# Altium schematic sheet AMU-S28-V00-USBCProtection.SchDoc
size A4; SheetNumber: 25; SheetTotal: 25
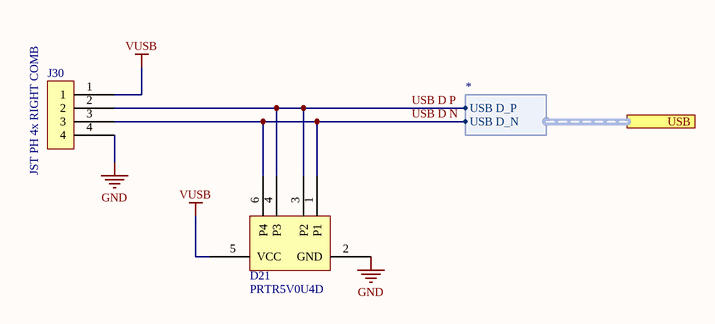
[diagram p0: AMU-S28-V00-USBCProtection.SchDoc]

## Parts
D21  PRTR5V0U4D  [SC-47]
J30  JST PH 4x RIGHT COMB  [JST PH 4x RIGHT COMB]

## Ports
USB (harness *)

## Harnesses
*: USB D_P, USB D_N

## Nets
GND: D21.2(GND) J30.4
VUSB: D21.5(VCC) J30.1
USB D N: D21.1(P1) D21.6(P4) J30.3 ; port USB.USB D_N
USB D P: D21.3(P2) D21.4(P3) J30.2 ; port USB.USB D_P

## Library data of the parts
D21 = PRTR5V0U4D: Clamp Ipp Tvs Diode Surface Mount 6-TSOP